# Altium project BatteryPack.PrjPcb
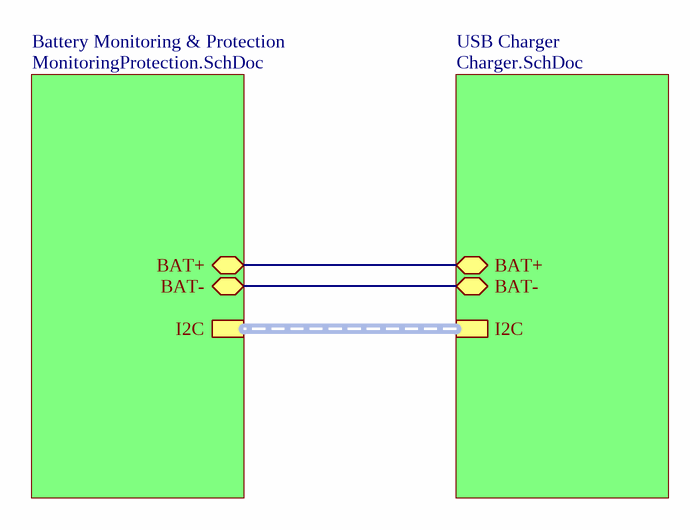
[diagram p0: Top.SchDoc]
seAuthor: Stefan Lüthi; seProject: robby; seRevision: 1.0
3 sheets, 60 parts. Net scope: hierarchical (ports join the sheet entries above them; power ports are global).
Board file: BatteryPack.PcbDoc
Sheets:
  Top.SchDoc
    Battery Monitoring & Protection = MonitoringProtection.SchDoc
    USB Charger = Charger.SchDoc

## Sheet Top.SchDoc
size A4; SheetNumber: 1; SheetTotal: 3

### Sub-sheets
Battery Monitoring & Protection = MonitoringProtection.SchDoc: BAT+ (bidir), I2C (harness I2C), BAT- (bidir)
USB Charger = Charger.SchDoc: BAT+ (bidir), I2C (harness I2C), BAT- (bidir)

### Nets
GND: sheet Battery Monitoring & Protection/BAT-, sheet USB Charger/BAT-
NetC301_2: sheet Battery Monitoring & Protection/BAT+, sheet USB Charger/BAT+

### Buses and harness runs
harness sheet Battery Monitoring & Protection/I2C = sheet USB Charger/I2C

### Notes on the sheet
- Project:
- Board:
- Title:
- Size:
- Sheet:
- A4
- of
- Drawn by:
- Revision:
- Date:
- Variant:
- Source Engineers GmbH | CH-3012 Bern
- File:

## Sheet MonitoringProtection.SchDoc
size A4; SheetNumber: 2; SheetTotal: 3
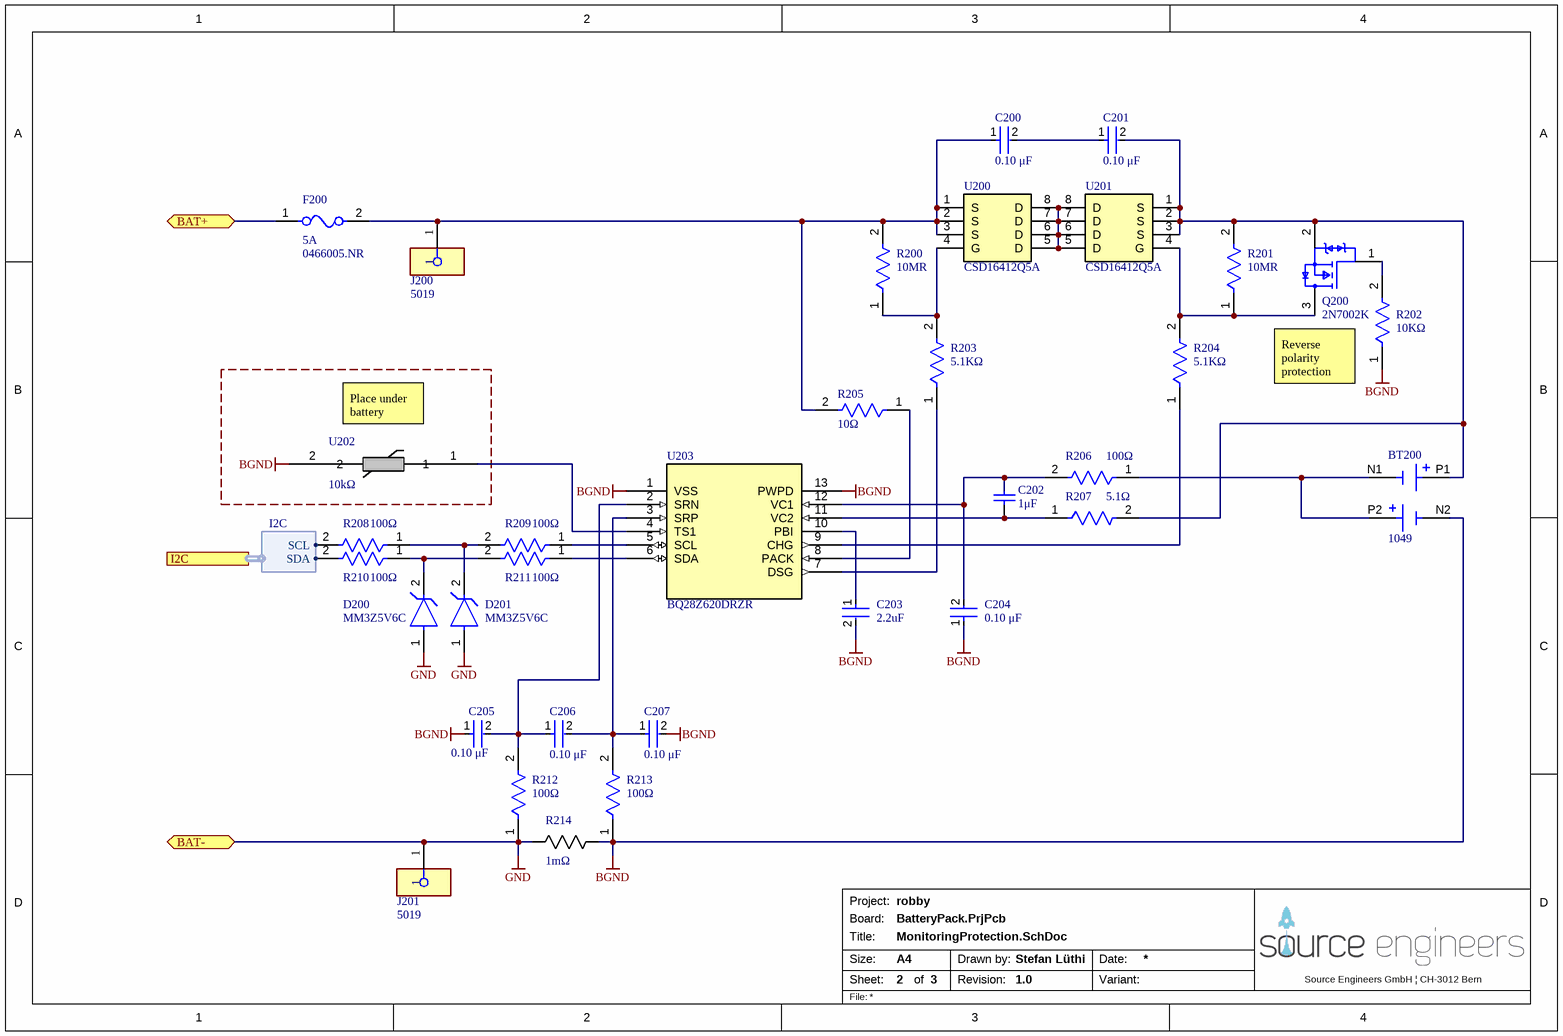
[diagram p1: MonitoringProtection.SchDoc]

### Parts
BT200  1049  [BAT1049]
C200  value 0.10 μF  [FP-C0603C-CF-MFG]  (hidden comment: C0603C104M5RACTU)
C201  value 0.10 μF  [FP-C0603C-CF-MFG]  (hidden comment: C0603C104M5RACTU)
C202  Parameter 1: 1μF  [CAPC2013X95X45NL10T25]  (hidden comment: GRM219R71E105KA88D)
C203  Capacitance: 2.2uF  [FP-GRM188-0_1-e0_2_0_5-MFG]  (hidden comment: GRM188R61E225KA12D)
C204  value 0.10 μF  [FP-C0603C-CF-MFG]  (hidden comment: C0603C104M5RACTU)
C205  value 0.10 μF  [FP-C0603C-CF-MFG]  (hidden comment: C0603C104M5RACTU)
C206  value 0.10 μF  [FP-C0603C-CF-MFG]  (hidden comment: C0603C104M5RACTU)
C207  value 0.10 μF  [FP-C0603C-CF-MFG]  (hidden comment: C0603C104M5RACTU)
D200  MM3Z5V6C  [FP-SOD-323F-MFG]
D201  MM3Z5V6C  [FP-SOD-323F-MFG]
F200  0466005.NR  Fuse Current: 5A  [FP-0466-MFG]
J200  5019  [FP-5019-MFG]
J201  5019  [FP-5019-MFG]
Q200  2N7002K  [FP-318-08-MFG]
R200  Resistance: 10MR  [FP-AC0603-IPC_C]  (hidden comment: AC0603FR-0710ML)
R201  Resistance: 10MR  [FP-AC0603-IPC_C]  (hidden comment: AC0603FR-0710ML)
R202  value 10KΩ  [FP-RT0603-MFG]  (hidden comment: RT0603FRE0710KL)
R203  Resistance: 5.1KΩ  [FP-RT0603-MFG]  (hidden comment: RT0603FRE075K1L)
R204  Resistance: 5.1KΩ  [FP-RT0603-MFG]  (hidden comment: RT0603FRE075K1L)
R205  Resistance: 10Ω  [FP-RT0603-MFG]  (hidden comment: RT0603FRE0710RL)
R206  Resistance: 100Ω  [FP-RT0603-MFG]  (hidden comment: RT0603FRE07100RL)
R207  Resistance: 5.1Ω  [FP-RT0603-MFG]  (hidden comment: RT0603FRE075R1L)
R208  Resistance: 100Ω  [FP-RT0603-MFG]  (hidden comment: RT0603FRE07100RL)
R209  Resistance: 100Ω  [FP-RT0603-MFG]  (hidden comment: RT0603FRE07100RL)
R210  Resistance: 100Ω  [FP-RT0603-MFG]  (hidden comment: RT0603FRE07100RL)
R211  Resistance: 100Ω  [FP-RT0603-MFG]  (hidden comment: RT0603FRE07100RL)
R212  Resistance: 100Ω  [FP-RT0603-MFG]  (hidden comment: RT0603FRE07100RL)
R213  Resistance: 100Ω  [FP-RT0603-MFG]  (hidden comment: RT0603FRE07100RL)
R214  Parameter 1: 1mΩ  [STA_CSNL1206_STP]  (hidden comment: CSNL1206FT1L00)
U200  CSD16412Q5A  [DQJ8]
U201  CSD16412Q5A  [DQJ8]
U202  Resistance: 10kΩ  [NTCS0603_VIS]  (hidden comment: NTCS0603E3103FLT)
U203  BQ28Z620DRZR  [VSON12_DRZ_TEX]

### Ports
BAT+ (bidir, see Top[2B], Charger[2B]), BAT- (bidir, see Top[2B], Charger[2B]), I2C (harness I2C, see Top[2C], Charger[4C])

### Harnesses
I2C: SCL, SDA

### Nets
BGND: BT200.N2(NEG2) C203.2 C204.1 C205.1 C207.2 R202.1 R213.1 R214.2 U202.2 U203.1(VSS) U203.13(PWPD)
GND: D200.1(A) D201.1(A) J201.1 R212.1 R214.1 ; port BAT-
NetBT200_N1: BT200.N1(NEG1) BT200.P2(POS2) R206.1
NetBT200_P1: BT200.P1(POS1) C201.2 Q200.2(Source) R201.2 R207.2 U201.1(S) U201.2(S) U201.3(S)
NetC200_1: C200.1 F200.2 J200.1 R200.2 R205.2 U200.1(S) U200.2(S) U200.3(S)
NetC200_2: C200.2 C201.1
NetC202_1: C202.1 R207.1 U203.11(VC2)
NetC202_2: C202.2 C204.2 R206.2 U203.12(VC1)
NetC203_1: C203.1 U203.10(PBI)
NetC205_2: C205.2 C206.1 R212.2 U203.2(SRN)
NetC206_2: C206.2 C207.1 R213.2 U203.3(SRP)
NetC301_2: F200.1 ; port BAT+
NetD200_2: D200.2(C) R210.1 R211.2
NetD201_2: D201.2(C) R208.1 R209.2
NetJ301_3: R208.2 ; port I2C.SCL
NetJ301_4: R210.2 ; port I2C.SDA
NetQ200_1: Q200.1(Gate) R202.2
NetQ200_3: Q200.3(Drain) R201.1 R204.2 U201.4(G)
NetR200_1: R200.1 R203.2 U200.4(G)
NetR203_1: R203.1 U203.7(DSG)
NetR204_1: R204.1 U203.9(CHG)
NetR205_1: R205.1 U203.8(PACK)
NetR209_1: R209.1 U203.5(SCL)
NetR211_1: R211.1 U203.6(SDA)
NetU200_5: U200.5(D) U200.6(D) U200.7(D) U200.8(D) U201.5(D) U201.6(D) U201.7(D) U201.8(D)
NetU202_1: U202.1 U203.4(TS1)

### Notes on the sheet
- Reverse polarity protection
- (near U202) Place under battery
- Project:
- Board:
- Title:
- Size:
- Sheet:
- A4
- of
- Drawn by:
- Revision:
- Date:
- Variant:
- Source Engineers GmbH | CH-3012 Bern
- File:

### Library data of the parts
BT200 = 1049: THM Holder for Dual 18650 Batteries; MF: Keystone Electronics; SnapEDA_Link: https://www.snapeda.com/parts/1049/Keystone/view-part/?ref=snap; Package: None; Value: *; MP: 1049; Check_prices: https://www.snapeda.com/parts/1049/Keystone/view-part/?ref=eda; Supplier 1: DigiKey; Supplier Part Number 1: 36-1049-ND; Supplier 2: Mouser; Supplier Part Number 2: 534-1049
C200 C201 C204-C207 = CMP-2006-03068-2: CAP CER 0.1UF 50V 20% X7R 0603; Manufacturer: KEMET; Material: Ceramic; Tolerance: 0.2; Temperature Coefficient: 30ppm/°C; Automotive Grade: Grade 1; Temperature Range High: +125°C; Voltage Rating: 50 V; Device Class L3: Ceramic Capacitors; Manufacturer Part Number: C0603C104M5RACTU; Height: 0.87mm; Category: Cap; RoHS: TRUE; Digikey Description: CAP CER 0.1UF 50V 20% X7R 0603; ComponentLink2URL: https://api.kemet.com/component-edge/download/datasheet/C0603C100J5GACAUTO.pdf; Lead Free: Yes; Temperature Range Low: -55°C; Device Class L1: Passive Components; ComponentLink2Description: Datasheet; Temperature Characteristic: X7R; Automotive: Yes; Temperature: -55°C to +125°C; Octopart: https://octopart.com/c0603c104m5ractu-kemet-11855687; Device Class L2: Capacitors; Package: C0603C-CF; Mouser Description: Multilayer Ceramic Capacitors MLCC - SMD/SMT 50volts 0.1uF X7R 20%; Capacitance: 0.10 μF
C202 = CMP-1036-04754-2: Manufacturer: Murata; Part Number: GRM219R71E105KA88D
C203 = CMP-2006-02820-2: Chip Multilayer Ceramic Capacitors for General Purpose, 0603, 2.2uF, X5R, 15%, 10%, 25V; Number of Pins: 2; Dielectric: X5R; Tolerance: 10%; Case Code (Imperial): 0603; Thickness: 0.035inch; Case/Package: 0603; Lead Free: Lead Free; Mount: Surface Mount; Material: Ceramic; Depth: 0.8mm; Voltage: 25V; Min Operating Temperature: -55°C; Package Quantity: 4000; REACH SVHC: No SVHC; Resistor Type: Ceramic; Packaging: Tape and Reel; Case Code (Metric): 1608; Max Operating Temperature: 85°C; Width: 0.8mm; Termination: SMD/SMT; Voltage Rating: 25V; Length: 1.6mm; Voltage Rating (DC): 25V; Height: 0.8mm; Radiation Hardening: No; Weight: 0.000222oz
D200 D201 = CMP-07164-000002-1: DIODE ZENER 5.6V 200MW SOD323F; Manufacturer: ON Semiconductor; Max Junction Temp: +150°C; Max Zener Voltage: 5.88V; Max Reverse Leakage Current: 0.9uA; Reverse Voltage: 2V; Zener Impedance: 37Ω; Device Class L2: Diodes; ComponentLink2Description: Datasheet; RoHS: TRUE; Digikey Description: DIODE ZENER 5.6V 200MW SOD323F; Mouser Description: Zener Diodes Diode Zener 5.6V 200mW 5%; ComponentLink2URL: https://www.onsemi.com/pub/Collateral/MM3Z9V1C-D.pdf; Octopart: https://octopart.com/mm3z5v6c-on+semiconductor-84329899; Category: Diode; Package: SOD-323F; Height: 1mm; Lead Free: Yes; Power Dissipation: 200mW; Temperature Range High: +150°C; Device Class L3: Zener Diodes; Automotive: No; Manufacturer Part Number: MM3Z5V6C; Nom Zener Voltage: 5.6V; Temperature: to +150°C; Device Class L1: Discrete Semiconductors
F200 = CMP-08605-000032-1: FUSE BOARD MNT 5A 32VAC/VDC 1206; Manufacturer: Littelfuse Inc; Value: 0.011Ω; Max Fuse Ac Voltage: 32V; Fuse I2T: 2.5A2Sec; Fuse Interrupt Ac Current: 50A; Fuse Blow Speed: Fast; Fuse Voltage Drop: 73.75mV; Category: Fuse; Temperature: -55°C to +90°C; Lead Free: Yes; Temperature Range High: +90°C; RoHS: TRUE; Device Class L2: Fuses; ComponentLink2URL: https://www.littelfuse.com/~/media/electronics/datasheets/fuses/littelfuse_fuse_466_datasheet.pdf.pdf; Octopart: https://octopart.com/0466005.nr-littelfuse-143206; Automotive: No; Max Fuse Dc Voltage: 32V; Temperature Range Low: -55°C; Device Class L3: unset; ComponentLink2Description: Datasheet; Manufacturer Part Number: 0466005.NR; Fuse Interrupt Dc Current: 50A; Resistance: 0.011Ω; Package: 0466; Device Class L1: Circuit Protection; Mouser Description: Surface Mount Fuses 32V 5A VFA Slimline; Height: 0.66mm; Voltage Rating: 32V; Digikey Description: FUSE BOARD MNT 5A 32VAC/VDC 1206
J200 J201 = CMP-1672-00008-2: NexarPartId: 22052288; Number of Contacts: 1; Contact Material: Bronze, Silver; Number of Pins: 1; Lead Free: Lead Free; Packaging: Tape and Reel; Mount: Surface Mount; Height: 2.286mm; Contact Plating: Silver; Material: Bronze; Termination: SMD/SMT; REACH SVHC: No SVHC; RoHS: Compliant
Q200 = CMP-07173-000009-1: MOSFET N-CH 60V 300MA SOT23; Manufacturer: ON Semiconductor; Turn Off Delay Time: 55.8ns; Max Forward Diode Voltage: 1.2V; Max Junction Temp: +150°C; Pulse Drain Current: 5A; Threshold Vgs Min: 1V; Depletion Mode: False; Drain To Source Resistance: 1.19Ω; Number Of N Channels: 1; Standoff Height: 0.01mm; Rthja Max: 417°C/W; Input Capacitace At Vds: 24.5pF @ 20V; Threshold Vgs Max: 2.3V; Turn On Delay Time: 12.2ns; Gate Charge At Vgs: 0.7nC @ 4.5V; Continuous Drain Current: 320mA; Transconductance: 0.53S; Power Dissipation: 300mW; Gate To Source Voltage: 20V; Typ Forward Diode Voltage: 0.8V; ComponentLink2URL: https://www.onsemi.com/pub/Collateral/2N7002K-D.pdf; RoHS: TRUE; Device Class L1: Discrete Semiconductors; ComponentLink2Description: Datasheet; Manufacturer Part Number: 2N7002K; Octopart: https://octopart.com/2n7002k-on+semiconductor-84408900; Device Class L3: MOSFETs; Mouser Description: N-Channel 60 V 2 Ohm SMT Enhancement Mode Field Effect Transistor SOT-23; Ipc Land Pattern Name: SOT95P240X100-3; Temperature Range High: +150°C; Temperature Range Low: -55°C; Lead Free: Yes; Height: 1.11mm; Package: 318-08; Footprint Url: https://www.onsemi.com/pub/Collateral/318-08.PDF; Temperature: -55°C to +150°C; Drain To Source Voltage: 60V; Device Class L2: Transistors; Drain To Source Breakdown Voltage: 60V; Digikey Description: MOSFET N-CH 60V 300MA SOT23; Number Of Channels: 1; Category: Trans; Automotive: No
R200 R201 = CMP-03412-018066-2: RES 10MΩ 1.00% 0.1W 0603; Voltage Rating: 50V; Temperature Coefficient: 100ppm/°C; Power Rating: 100mW; Tolerance: 1%; Length: 0.063inch; Weight: 7.1E-05oz; RoHS Compliant: Yes; Packaging: Tape and Reel; Features: Moisture Resistant; Series: AC; Max Power Dissipation: 100mW; Case Code (Metric): 1608; Width: 0.8mm; Number of Terminations: 2; Resistor Type: Thick Film; Min Operating Temperature: -55°C; Case Code (Imperial): 0603; Height: 0.022inch; Max Operating Temperature: 155°C; Case/Package: 0603; Termination: SMD/SMT
R202 = CMP-03412-005349-1: RES SMD 10K OHM 1% 1/10W 0603; Manufacturer: Yageo; Temperature Coefficient: 50 ppm/°C; Power Rating: 0.1W; Tolerance: 0.01; Voltage Rating: 75V; RoHS: TRUE; Category: Res; Automotive: No; Digikey Description: RES SMD 10K OHM 1% 1/10W 0603; ComponentLink2Description: Datasheet; Octopart: https://octopart.com/rt0603fre0710kl-yageo-40009243; ComponentLink2URL: http://www.yageo.com/documents/recent/PYu-RT_1-to-0.01_RoHS_L_9.pdf; Device Class L3: Chip SMD Resistors; Device Class L1: Passive Components; Temperature Range High: +155°C; Height: 0.55mm; Composition: Thin Film; Ipc Land Pattern Name: RESC16080X45; Series: RT; Package: RT0603; Resistance: 10KΩ; Footprint Url: http://www.yageo.com/exep/pages/download/literatures/PYu-R_Mount_10.pdf; Temperature: -55°C to +155°C; Temperature Range Low: -55°C; Lead Free: Yes; Device Class L2: Resistors; Mouser Description: Thin Film Resistors - SMD 10K ohm 1% 1/10W; Manufacturer Part Number: RT0603FRE0710KL
R203 R204 = CMP-2000-04778-2: RES SMD 5.1K OHM 1% 1/10W 0603; Manufacturer: Yageo; Value: 5.1KΩ; Temperature Coefficient: 50 ppm/°C; Power Rating: 0.1W; Voltage Rating: 75V; Tolerance: 0.01; Lead Free: Yes; Temperature Range High: +155°C; Package: RT0603; Series: RT; Footprint Url: http://www.yageo.com/exep/pages/download/literatures/PYu-R_Mount_10.pdf; Ipc Land Pattern Name: RESC16080X45; Mouser Description: Res Thin Film 0603 5.1K Ohm 1% 0.1W(1/10W) ±50ppm/C Epoxy Pad SMD T/R; Octopart: https://octopart.com/rt0603fre075k1l-yageo-1421390; ComponentLink2URL: http://www.yageo.com/documents/recent/PYu-RT_1-to-0.01_RoHS_L_9.pdf; Manufacturer Part Number: RT0603FRE075K1L; RoHS: TRUE; Device Class L3: Chip SMD Resistors; Digikey Description: RES SMD 5.1K OHM 1% 1/10W 0603; Temperature: -55°C to +155°C; Height: 0.55mm; Automotive: No; Device Class L1: Passive Components; Temperature Range Low: -55°C; Category: Res; Composition: Thin Film; ComponentLink2Description: Datasheet; Device Class L2: Resistors
R205 = CMP-03412-033408-1: RES SMD 10 OHM 1% 1/10W 0603; Manufacturer: Yageo; Voltage Rating: 75V; Power Rating: 0.1W; Temperature Coefficient: 50 ppm/°C; Tolerance: 0.01; Value: 10Ω; Footprint Url: http://www.yageo.com/exep/pages/download/literatures/PYu-R_Mount_10.pdf; Ipc Land Pattern Name: RESC16080X45; RoHS: TRUE; Device Class L2: Resistors; Device Class L3: Chip SMD Resistors; Category: Res; Device Class L1: Passive Components; Manufacturer Part Number: RT0603FRE0710RL; ComponentLink2URL: http://www.yageo.com/documents/recent/PYu-RT_1-to-0.01_RoHS_L_9.pdf; Temperature Range Low: -55°C; Height: 0.55mm; Digikey Description: RES SMD 10 OHM 1% 1/10W 0603; Temperature Range High: +155°C; Lead Free: Yes; Composition: Thin Film; Mouser Description: Thin Film Resistors - SMD 1/10W 10 ohm 1% 50ppm; Automotive: No; Package: RT0603; Temperature: -55°C to +155°C; Series: RT; ComponentLink2Description: Datasheet; Octopart: https://octopart.com/rt0603fre0710rl-yageo-39827693
R206 R208-R213 = CMP-03412-022806-1: RES SMD 100 OHM 1% 1/10W 0603; Manufacturer: Yageo; Value: 100Ω; Power Rating: 0.1W; Voltage Rating: 75V; Temperature Coefficient: 50 ppm/°C; Tolerance: 0.01; Manufacturer Part Number: RT0603FRE07100RL; Mouser Description: Thin Film Resistors - SMD 1/10W 100 ohm 1% 50ppm; Ipc Land Pattern Name: RESC16080X45; Height: 0.55mm; Category: Res; Temperature Range Low: -55°C; Lead Free: Yes; Automotive: No; Device Class L3: Chip SMD Resistors; ComponentLink2Description: Datasheet; Device Class L2: Resistors; RoHS: TRUE; Footprint Url: http://www.yageo.com/exep/pages/download/literatures/PYu-R_Mount_10.pdf; Digikey Description: RES SMD 100 OHM 1% 1/10W 0603; Temperature Range High: +155°C; Package: RT0603; Device Class L1: Passive Components; Series: RT; Temperature: -55°C to +155°C; Octopart: https://octopart.com/rt0603fre07100rl-yageo-39792638; Composition: Thin Film; ComponentLink2URL: http://www.yageo.com/documents/recent/PYu-RT_1-to-0.01_RoHS_L_9.pdf
R207 = CMP-03412-016927-1: RES SMD 5.1 OHM 1% 1/10W 0603; Manufacturer: Yageo; Tolerance: 0.01; Voltage Rating: 75V; Value: 5.1Ω; Temperature Coefficient: 50 ppm/°C; Power Rating: 0.1W; ComponentLink2URL: http://www.yageo.com/documents/recent/PYu-RT_1-to-0.01_RoHS_L_9.pdf; Temperature Range High: +155°C; Manufacturer Part Number: RT0603FRE075R1L; Composition: Thin Film; Octopart: https://octopart.com/rt0603fre075r1l-yageo-25630341; Device Class L1: Passive Components; Digikey Description: RES SMD 5.1 OHM 1% 1/10W 0603; Series: RT; Lead Free: Yes; Device Class L3: Chip SMD Resistors; Temperature: -55°C to +155°C; ComponentLink2Description: Datasheet; Category: Res; Height: 0.55mm; Package: RT0603; Automotive: No; Ipc Land Pattern Name: RESC16080X45; Device Class L2: Resistors; Footprint Url: http://www.yageo.com/exep/pages/download/literatures/PYu-R_Mount_10.pdf; RoHS: TRUE; Temperature Range Low: -55°C
R214 = CSNL1206FT1L00: Description; Manufacturer_Name: Stackpole International; Copyright: Copyright (C) 2025 Ultra Librarian. All rights reserved.; Manufacturer_Part_Number: CSNL1206FT1L00; Supplier 1: DigiKey; Supplier Part Number 1: CSNL1206FT1L00CT-ND; Supplier 2: DigiKey; Supplier Part Number 2: CSNL1206FT1L00DKR-ND; Supplier 3: DigiKey; Supplier Part Number 3: CSNL1206FT1L00TR-ND; Supplier 4: Mouser; Supplier Part Number 4: 708-CSNL1206FT1L00
U200 U201 = CSD16412Q5A: 25-V, N channel NexFETâ„¢ power MOSFET, single SON 5 mm x 6 mm, 16 mOhm 8-VSONP -55 to 150; Manufacturer_Name: Texas Instruments; Copyright: Copyright (C) 2025 Ultra Librarian. All rights reserved.; Manufacturer_Part_Number: CSD16412Q5A; Datasheet: https://www.ti.com/lit/gpn/csd16412q5a; RefDes: RefDes; Type: Type; Supplier 1: DigiKey; Supplier Part Number 1: 296-24256-1-ND; Supplier 2: DigiKey; Supplier Part Number 2: 296-24256-6-ND; Supplier 3: Mouser; Supplier Part Number 3: 595-CSD16412Q5A
U202 = CMP-02404-000014-2: THERMISTOR NTC 10KOHM 3435K 0603; NexarPartId: 44562204; Tolerance: 1%; Power Rating: 125mW; Case Code (Metric): 1608; Packaging: Cut Tape (CT); Min Operating Temperature: -40°C; RoHS: Compliant; Height: 800µm; Depth: 800µm; Case/Package: 0603; Length: 1.6mm; Number of Pins: 2; Termination: SMD/SMT; Schedule B: 8533400080, 8533400080; Weight: 1.19068mg; Contact Plating: Tin; Max Power Dissipation: 125mW; Max Operating Temperature: 150°C; Mount: Surface Mount; Case Code (Imperial): 0603; Width: 800µm
U203 = BQ28Z620DRZR: Battery fuel gauge with integrated protector for 1-series to 2 series packs with 1.2-V I/O 12-SON -40 to 85; Manufacturer_Name: Texas Instruments; Type: Power Management; Copyright: Copyright (C) 2025 Ultra Librarian. All rights reserved.; Manufacturer_Part_Number: BQ28Z620DRZR; RefDes: RefDes; Supplier 1: DigiKey; Supplier Part Number 1: 296-BQ28Z620DRZRCT-ND; Supplier 2: DigiKey; Supplier Part Number 2: 296-BQ28Z620DRZRDKR-ND; Supplier 3: Mouser; Supplier Part Number 3: 595-BQ28Z620DRZR

## Sheet Charger.SchDoc
size A4; SheetNumber: 3; SheetTotal: 3
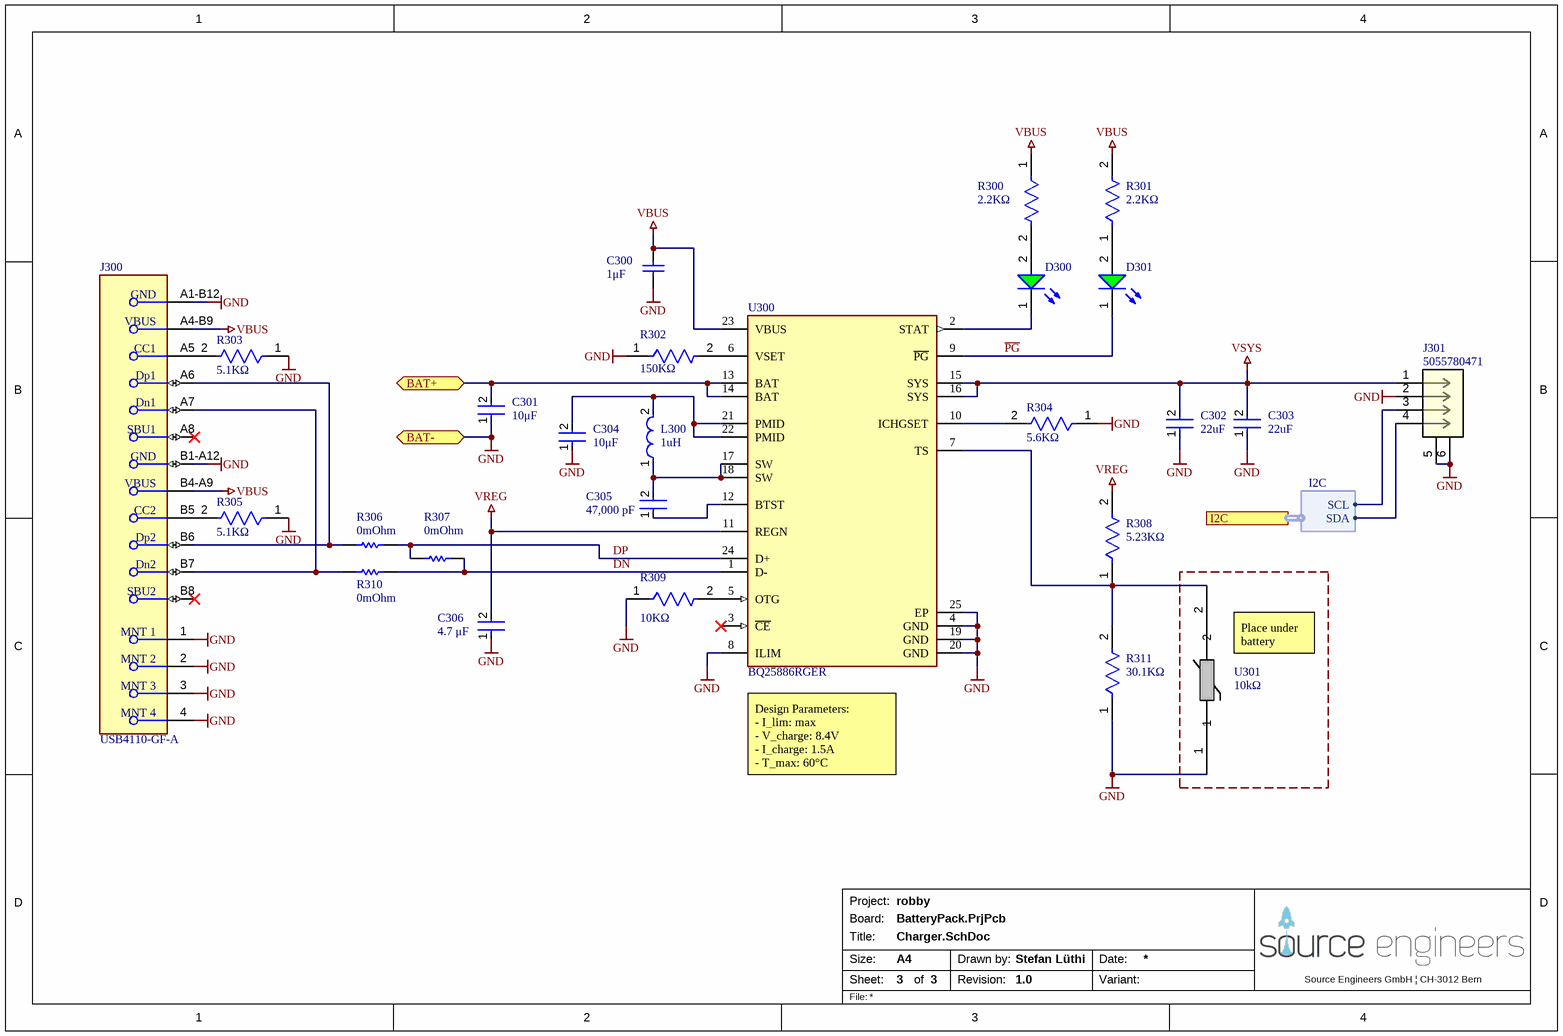
[diagram p2: Charger.SchDoc]

### Parts
C300  Parameter 1: 1μF  [CAPC2013X95X45NL10T25]  (hidden comment: GRM219R71E105KA88D)
C301  value 10μF  [FP-GRM31C-0_2-e0_3_0_8-IPC_B]  (hidden comment: GRM31CR71E106MA12K)
C302  Capacitance: 22uF  [FP-GRM32E-0_3-0_2-MFG]  (hidden comment: GRM32ER71E226ME15K)
C303  Capacitance: 22uF  [FP-GRM32E-0_3-0_2-MFG]  (hidden comment: GRM32ER71E226ME15K)
C304  value 10μF  [FP-GRM31C-0_2-e0_3_0_8-IPC_B]  (hidden comment: GRM31CR71E106MA12K)
C305  value 47,000 pF  [FP-C0603C-CF-MFG]  (hidden comment: C0603C473M5RACTU)
C306  Parameter 1: 4.7 μF  [FP-GRM188-0_15-IPC_B]  (hidden comment: GRM188Z71A475ME15D)
D300  155060VS75300  [WL-SMSW_0603_L1.6W0.98H0.8]  (value not drawn)
D301  155060VS75300  [WL-SMSW_0603_L1.6W0.98H0.8]  (value not drawn)
J300  USB4110-GF-A  [FP-USB4110-GF-A-MFG]
J301  5055780471  [CONN_505578_04_MOL]
L300  Inductance: 1uH  [FP-IHLP-2525CZ-FP_2_413x3-MFG]  (hidden comment: IHLP2525CZER1R0M01)
R300  value 2.2KΩ  [FP-RT0603-MFG]  (hidden comment: RT0603FRE072K2L)
R301  value 2.2KΩ  [FP-RT0603-MFG]  (hidden comment: RT0603FRE072K2L)
R302  value 150KΩ  [FP-RT0603-MFG]  (hidden comment: RT0603FRE07150KL)
R303  Resistance: 5.1KΩ  [FP-RT0603-MFG]  (hidden comment: RT0603FRE075K1L)
R304  value 5.6KΩ  [FP-RT0603-MFG]  (hidden comment: RT0603FRE075K6L)
R305  Resistance: 5.1KΩ  [FP-RT0603-MFG]  (hidden comment: RT0603FRE075K1L)
R306  Resistance: 0mOhm  [RESC1608X55X25ML10T15]  (hidden comment: RC0603JR-070RL)
R307  Resistance: 0mOhm  [RESC1608X55X25ML10T15]  (hidden comment: RC0603JR-070RL)
R308  value 5.23KΩ  [FP-RT0603-MFG]  (hidden comment: RT0603FRE075K23L)
R309  value 10KΩ  [FP-RT0603-MFG]  (hidden comment: RT0603FRE0710KL)
R310  Resistance: 0mOhm  [RESC1608X55X25ML10T15]  (hidden comment: RC0603JR-070RL)
R311  value 30.1KΩ  [FP-RT0603-MFG]  (hidden comment: RT0603FRE0730K1L)
U300  BQ25886RGER  [FP-RGE0024H-IPC_C]
U301  Resistance: 10kΩ  [NTCS0603_VIS]  (hidden comment: NTCS0603E3103FLT)

### Ports
BAT+ (bidir, see Top[3B], MonitoringProtection[1A]), BAT- (bidir, see Top[3B], MonitoringProtection[1D]), I2C (harness I2C, see Top[3C], MonitoringProtection[1C])

### Harnesses
I2C: SCL, SDA

### Nets
GND: C300.1 C301.1 C302.1 C303.1 C304.1 C306.1 J300.1(MNT_1) J300.2(MNT_2) J300.3(MNT_3) J300.4(MNT_4) J300.A1-B12(GND) J300.B1-A12(GND) J301.2 J301.5 J301.6 R302.1 R303.1 R304.1 R305.1 R309.1 R311.1 U300.4(GND) U300.8(ILIM) U300.19(GND) U300.20(GND) U300.25(EP) U301.1 ; port BAT-
VBUS: C300.2 J300.A4-B9(VBUS) J300.B4-A9(VBUS) R300.1 R301.2 U300.23(VBUS)
VREG: C306.2 R308.2 U300.11(REGN)
VSYS: C302.2 C303.2 J301.1 U300.15(SYS) U300.16(SYS)
DN: R307.1 R310.1 U300.1(D-)
DP: R306.1 R307.2 U300.24(D+)
~{PG}: D301.1(K) U300.9(~{PG})
NetC301_2: C301.2 U300.13(BAT) U300.14(BAT) ; port BAT+
NetC304_2: C304.2 L300.2 U300.21(PMID) U300.22(PMID)
NetC305_1: C305.1 U300.12(BTST)
NetC305_2: C305.2 L300.1 U300.17(SW) U300.18(SW)
NetD300_1: D300.1(K) U300.2(STAT)
NetD300_2: D300.2(A) R300.2
NetD301_2: D301.2(A) R301.1
NetJ300_A5: J300.A5(CC1) R303.2
NetJ300_A6: J300.A6(Dp1) J300.B6(Dp2) R306.2
NetJ300_A7: J300.A7(Dn1) J300.B7(Dn2) R310.2
NetJ300_B5: J300.B5(CC2) R305.2
NetJ301_3: J301.3 ; port I2C.SCL
NetJ301_4: J301.4 ; port I2C.SDA
NetR302_2: R302.2 U300.6(VSET)
NetR304_2: R304.2 U300.10(ICHGSET)
NetR308_1: R308.1 R311.2 U300.7(TS) U301.2
NetR309_2: R309.2 U300.5(OTG)

Not connected (* = marked no-connect by the designer): J300 A8(SBU1)* B8(SBU2)*; U300 3(~{CE})*

### Notes on the sheet
- (near U301) Place under battery
- (near U300) Design Parameters:
  - I_lim: max
  - V_charge: 8.4V
  - I_charge: 1.5A
  - T_max: 60°C
- Project:
- Board:
- Title:
- Size:
- Sheet:
- A4
- of
- Drawn by:
- Revision:
- Date:
- Variant:
- Source Engineers GmbH | CH-3012 Bern
- File:

### Library data of the parts
C300 = CMP-1036-04754-2: Manufacturer: Murata; Part Number: GRM219R71E105KA88D
C301 C304 = CMP-06035-043219-1: Chip Multilayer Ceramic Capacitors for General Purpose, 1206, 10uF, X7R, 15%, 20%, 25V
C302 C303 = CMP-06035-000114-2: Chip Multilayer Ceramic Capacitors for General Purpose, 1210, 22uF, X7R, 15%, 20%, 25V; Case Code (Metric): 3225; Thickness: 0.106inch; Voltage Rating: 25V; Weight: 0.00388oz; Width: 0.098inch; Case Code (Imperial): 1210; Tolerance: 20%; Termination: SMD/SMT; Packaging: Tape and Reel; Case/Package: 1210; Height: 2.5mm; Mount: Surface Mount; Voltage Rating (DC): 25V; Resistor Type: Ceramic; Voltage: 25V; Dielectric: X7R; Package Quantity: 4000; Min Operating Temperature: -55°C; Max Operating Temperature: 125°C; Length: 0.126inch
C305 = CMP-2006-03851-2: CAP CER 0.047UF 50V X7R 0603; Manufacturer: KEMET; Temperature Coefficient: 30ppm/°C; Automotive Grade: Grade 1; Tolerance: 0.2; Material: Ceramic; Voltage Rating: 50 V; Manufacturer Part Number: C0603C473M5RACTU; Device Class L1: Passive Components; Temperature Range High: +125°C; Height: 0.87mm; Device Class L3: Ceramic Capacitors; Capacitance: 47,000 pF; Digikey Description: CAP CER 0.047UF 50V X7R 0603; Temperature Range Low: -55°C; Temperature: -55°C to +125°C; Mouser Description: Cap Ceramic 0.047uF 50V X7R 20% SMD 0603 125°C Paper T/R; ComponentLink2URL: https://api.kemet.com/component-edge/download/datasheet/C0603C100J5GACAUTO.pdf; Package: C0603C-CF; Automotive: Yes; RoHS: TRUE; ComponentLink2Description: Datasheet; Lead Free: Yes; Device Class L2: Capacitors; Temperature Characteristic: X7R; Category: Cap; Octopart: https://octopart.com/c0603c473m5ractu-kemet-9140001
C306 = CMP-06035-024346-1: Chip Multilayer Ceramic Capacitors for General Purpose, 0603, 4.7uF, X7R, 15%, 20%, 10V; Case/Package: 0603
D300 D301 = CMP-03913-108242161-1: 155060VS75300 Led, Green, 60Mcd, 570Nm Rohs Compliant: Yes; Max Reverse Voltage (DC): 5V; Peak Wavelength: 572nm; Viewing Angle: 140°; Forward Current: 30mA; Forward Voltage: 2V; Max Operating Temperature: 85°C; Luminous Intensity: 60mcd; RoHS: Compliant; Width: 980µm; Length: 1.6mm; Min Operating Temperature: -40°C; Dominant Wavelength: 570nm; Height: 800µm; NexarPartId: 108242161
J300 = CMP-245163-000002-1: CONN USB 2.0 TYPE-C R/A SMT; Manufacturer: GCT; Conn Orientation: Right Angle; Usb Standard: USB 2.0; Voltage Rating: 20V; Current Rating: 3/4.25/1.25/0.25A; Number Of Contacts: 16; Is Female: yes; Shielding: true; Standoff Height: 0.1mm; Octopart: https://octopart.com/usb4110-gf-a-gct-103941985; Temperature: -40°C to +85°C; RoHS: TRUE; Automotive: No; Contact Material: Gold,Nickel; Device Class L1: Connectors; Device Class L2: USB Connectors; Package: 0; Lead Free: Yes; ComponentLink2URL: https://gct.co/files/drawings/usb4110.pdf; Temperature Range High: +85°C; Temperature Range Low: -40°C; Height: 3.46mm; Manufacturer Part Number: USB4110-GF-A; ComponentLink2Description: Datasheet; Device Class L3: unset; Digikey Description: CONN USB 2.0 TYPE-C R/A SMT; Category: Conn
J301 = 5055780471: 2.00mm Pitch, Micro-Lock Plus PCB Header, Single Row, Right-Angle, Surface Mount, Matte Tin Plating, Positive Lock, 4 Circuits, Low-Halogen, Black; Manufacturer_Name: Molex Connector Corporation; Copyright: Copyright (C) 2025 Ultra Librarian. All rights reserved.; Manufacturer_Part_Number: 5055780471; Datasheet: https://www.molex.com/en-us/products/part-detail-pdf/5055780471?display=pdf; RefDes: RefDes; Type: Type; Supplier 1: DigiKey; Supplier Part Number 1: WM17949CT-ND; Supplier 2: DigiKey; Supplier Part Number 2: WM17949DKR-ND; Supplier 3: Mouser; Supplier Part Number 3: 538-505578-0471
L300 = CMP-02424-000599-1: Commercial Inductors, High Saturation Series 1uH 11A 10mΩ 20%; Self Resonant Frequency: 5MHz; Test Frequency: 100kHz; Shielding: Shielded; Core Material: Metal; Saturation Current: 22A; DC Resistance (DCR): 10mR; Current Rating: 11A; Packaging: Tape and Reel; Width: 6.47mm; Number of Pins: 2; Case/Package: 2525; Termination: SMD/SMT; Length: 7.24mm; Height: 3mm; Min Operating Temperature: -55°C; Mount: Surface Mount; Inductance Tolerance: 20%; Max Operating Temperature: 125°C; Military Standard: Not; Max DC Current: 11A; RMS Current (Irms): 11A; Lead Free: Lead Free; Depth: 6.72mm; Tolerance: 20%; Package Quantity: 2000; Radiation Hardening: No; Contact Plating: Tin
R300 R301 = CMP-03412-033768-1: RES SMD 2.2K OHM 1% 1/10W 0603; Manufacturer: Yageo; Temperature Coefficient: 50 ppm/°C; Power Rating: 0.1W; Tolerance: 0.01; Voltage Rating: 75V; Package: RT0603; Digikey Description: RES SMD 2.2K OHM 1% 1/10W 0603; Octopart: https://octopart.com/rt0603fre072k2l-yageo-40019811; ComponentLink2URL: http://www.yageo.com/documents/recent/PYu-RT_1-to-0.01_RoHS_L_9.pdf; Temperature Range Low: -55°C; Height: 0.55mm; Footprint Url: http://www.yageo.com/exep/pages/download/literatures/PYu-R_Mount_10.pdf; ComponentLink2Description: Datasheet; Device Class L1: Passive Components; RoHS: TRUE; Device Class L3: Chip SMD Resistors; Composition: Thin Film; Device Class L2: Resistors; Manufacturer Part Number: RT0603FRE072K2L; Mouser Description: High Precision-High Stability Chip Resistor Thin Film 0603 2.2kOhm 1% Paper T/R; Automotive: No; Category: Res; Temperature Range High: +155°C; Lead Free: Yes; Resistance: 2.2KΩ; Temperature: -55°C to +155°C; Series: RT; Ipc Land Pattern Name: RESC16080X45
R302 = CMP-03412-003286-1: RES SMD 150K OHM 1% 1/10W 0603; Manufacturer: Yageo; Power Rating: 0.1W; Voltage Rating: 75V; Tolerance: 0.01; Temperature Coefficient: 50 ppm/°C; Temperature Range Low: -55°C; Category: Res; Mouser Description: High Precision-High Stability Chip Resistor Thin Film 0603 150kOhm 1% Paper T/R; Temperature Range High: +155°C; ComponentLink2Description: Datasheet; Digikey Description: RES SMD 150K OHM 1% 1/10W 0603; Ipc Land Pattern Name: RESC16080X45; Automotive: No; Temperature: -55°C to +155°C; Package: RT0603; Device Class L2: Resistors; RoHS: TRUE; Footprint Url: http://www.yageo.com/exep/pages/download/literatures/PYu-R_Mount_10.pdf; ComponentLink2URL: http://www.yageo.com/documents/recent/PYu-RT_1-to-0.01_RoHS_L_9.pdf; Composition: Thin Film; Manufacturer Part Number: RT0603FRE07150KL; Octopart: https://octopart.com/rt0603fre07150kl-yageo-39990114; Resistance: 150KΩ; Lead Free: Yes; Height: 0.55mm; Series: RT; Device Class L3: Chip SMD Resistors; Device Class L1: Passive Components
R303 R305 = CMP-2000-04778-2: as R203 on sheet MonitoringProtection; Lead Free: Yes; Temperature Range High: +155°C; Package: RT0603; Series: RT; Footprint Url: http://www.yageo.com/exep/pages/download/literatures/PYu-R_Mount_10.pdf; Ipc Land Pattern Name: RESC16080X45; Mouser Description: Res Thin Film 0603 5.1K Ohm 1% 0.1W(1/10W) ±50ppm/C Epoxy Pad SMD T/R; Octopart: https://octopart.com/rt0603fre075k1l-yageo-1421390; ComponentLink2URL: http://www.yageo.com/documents/recent/PYu-RT_1-to-0.01_RoHS_L_9.pdf; Manufacturer Part Number: RT0603FRE075K1L; RoHS: TRUE; Device Class L3: Chip SMD Resistors; Digikey Description: RES SMD 5.1K OHM 1% 1/10W 0603; Temperature: -55°C to +155°C; Height: 0.55mm; Automotive: No; Device Class L1: Passive Components; Temperature Range Low: -55°C; Category: Res; Composition: Thin Film; ComponentLink2Description: Datasheet; Device Class L2: Resistors
R304 = CMP-03412-009081-1: RES SMD 5.6K OHM 1% 1/10W 0603; Manufacturer: Yageo; Tolerance: 0.01; Voltage Rating: 75V; Temperature Coefficient: 50 ppm/°C; Power Rating: 0.1W; Package: RT0603; Manufacturer Part Number: RT0603FRE075K6L; Footprint Url: http://www.yageo.com/exep/pages/download/literatures/PYu-R_Mount_10.pdf; Composition: Thin Film; Category: Res; RoHS: TRUE; Resistance: 5.6KΩ; ComponentLink2Description: Datasheet; Lead Free: Yes; Automotive: No; Temperature Range Low: -55°C; Series: RT; Temperature: -55°C to +155°C; Mouser Description: Res Thin Film 0603 5.6K Ohm 1% 1/10W ?50ppm/C Molded SMD SMD Paper T/R; Temperature Range High: +155°C; Device Class L3: Chip SMD Resistors; Digikey Description: RES SMD 5.6K OHM 1% 1/10W 0603; Octopart: https://octopart.com/rt0603fre075k6l-yageo-40030215; Device Class L2: Resistors; Ipc Land Pattern Name: RESC16080X45; Device Class L1: Passive Components; ComponentLink2URL: http://www.yageo.com/documents/recent/PYu-RT_1-to-0.01_RoHS_L_9.pdf; Height: 0.55mm
R306 R307 R310 = CMP-2100-03667-1: Chip Resistor, 0 Ohm, +/- 5%, 0.1 W, -55 to 155 degC, 0603 (1608 Metric), RoHS, Tape and Reel; Manufacturer: Yageo; Temperature Coefficient: 200ppm/degreesC; Voltage Rating: 50V; Power Rating: 100mW; Width: 0.8mm; Max Operating Temperature: 155degC; Tolerance: 5%; Package Reference: 0603; Height: 0.45mm; Depth: 0.8mm; Package Description: 2-Pin Surface Mount Device, Body 1.6 x 0.8 mm; Termination: SMD/SMT; Package Quantity: 5000; Case/Package: 0603; Case Code (Imperial): 0603; Radiation Hardening: No; Number of Pins: 2; Length: 1.6mm; Lead Free: LeadFree; Voltage Rating (DC): 50V; Military Standard: Not; Datasheet URL: http://www.yageo.com/NewPortal/yageodocoutput?fileName=/pdf/R-Chip/PYu-RC_Group_51_RoHS_L_5.pdf; Manufacturer URL: http://www.yageo.com/; Packaging: TapeandReel; Case Code (Metric): 1608; Min Operating Temperature: -55degC; Composition: ThickFilm; RoHSCompliant: true; Contact Plating: Tin; Datasheet Version: Rev. 5, 10/2016; REACH SVHC: NoSVHC
R308 = CMP-03412-006003-1: RES SMD 5.23K OHM 1% 1/10W 0603; Manufacturer: Yageo; Temperature Coefficient: 50 ppm/°C; Voltage Rating: 75V; Power Rating: 0.1W; Tolerance: 0.01; Device Class L2: Resistors; Temperature Range High: +155°C; ComponentLink2Description: Datasheet; Octopart: https://octopart.com/rt0603fre075k23l-yageo-1422860; Height: 0.55mm; Mouser Description: Thin Film Resistors 1/10W 5.23K ohm 1% 50ppm; Manufacturer Part Number: RT0603FRE075K23L; Composition: Thin Film; Series: RT; Resistance: 5.23KΩ; Automotive: No; Device Class L1: Passive Components; RoHS: TRUE; Package: RT0603; Lead Free: Yes; Footprint Url: http://www.yageo.com/exep/pages/download/literatures/PYu-R_Mount_10.pdf; Temperature Range Low: -55°C; ComponentLink2URL: http://www.yageo.com/documents/recent/PYu-RT_1-to-0.01_RoHS_L_9.pdf; Device Class L3: Chip SMD Resistors; Digikey Description: RES SMD 5.23K OHM 1% 1/10W 0603; Ipc Land Pattern Name: RESC16080X45; Temperature: -55°C to +155°C; Category: Res
R309 = CMP-03412-005349-1: as R202 on sheet MonitoringProtection; RoHS: TRUE; Category: Res; Automotive: No; Digikey Description: RES SMD 10K OHM 1% 1/10W 0603; ComponentLink2Description: Datasheet; Octopart: https://octopart.com/rt0603fre0710kl-yageo-40009243; ComponentLink2URL: http://www.yageo.com/documents/recent/PYu-RT_1-to-0.01_RoHS_L_9.pdf; Device Class L3: Chip SMD Resistors; Device Class L1: Passive Components; Temperature Range High: +155°C; Height: 0.55mm; Composition: Thin Film; Ipc Land Pattern Name: RESC16080X45; Series: RT; Package: RT0603; Resistance: 10KΩ; Footprint Url: http://www.yageo.com/exep/pages/download/literatures/PYu-R_Mount_10.pdf; Temperature: -55°C to +155°C; Temperature Range Low: -55°C; Lead Free: Yes; Device Class L2: Resistors; Mouser Description: Thin Film Resistors - SMD 10K ohm 1% 1/10W; Manufacturer Part Number: RT0603FRE0710KL
R311 = CMP-2000-04723-2: RES SMD 30.1K OHM 1% 1/10W 0603; Manufacturer: Yageo; Power Rating: 0.1W; Temperature Coefficient: 50 ppm/°C; Tolerance: 0.01; Voltage Rating: 75V; RoHS: TRUE; Temperature: -55°C to +155°C; Device Class L3: Chip SMD Resistors; Lead Free: Yes; Temperature Range Low: -55°C; ComponentLink2Description: Datasheet; Automotive: No; Height: 0.55mm; Footprint Url: http://www.yageo.com/exep/pages/download/literatures/PYu-R_Mount_10.pdf; ComponentLink2URL: http://www.yageo.com/documents/recent/PYu-RT_1-to-0.01_RoHS_L_9.pdf; Octopart: https://octopart.com/rt0603fre0730k1l-yageo-1278177; Series: RT; Ipc Land Pattern Name: RESC16080X45; Category: Res; Digikey Description: RES SMD 30.1K OHM 1% 1/10W 0603; Device Class L1: Passive Components; Package: RT0603; Composition: Thin Film; Temperature Range High: +155°C; Mouser Description: Res Thin Film 0603 30.1K Ohm 1% 1/10W ±50ppm/°C SMD Paper T/R; Device Class L2: Resistors; Manufacturer Part Number: RT0603FRE0730K1L; Resistance: 30.1KΩ
U300 = CMP-04911-000046-1: PWR MGMT BATTERY MGMT
U301 = CMP-02404-000014-2: as U202 on sheet MonitoringProtection; Case Code (Metric): 1608; Packaging: Cut Tape (CT); Min Operating Temperature: -40°C; RoHS: Compliant; Height: 800µm; Depth: 800µm; Case/Package: 0603; Length: 1.6mm; Number of Pins: 2; Termination: SMD/SMT; Schedule B: 8533400080, 8533400080; Weight: 1.19068mg; Contact Plating: Tin; Max Power Dissipation: 125mW; Max Operating Temperature: 150°C; Mount: Surface Mount; Case Code (Imperial): 0603; Width: 800µm

## Nets that join several sheets
GND: MonitoringProtection (5 pins), Charger (27 pins)
NetC301_2: MonitoringProtection (F200.1), Charger (C301.2 U300.13 U300.14)
NetJ301_3: MonitoringProtection (R208.2), Charger (J301.3)
NetJ301_4: MonitoringProtection (R210.2), Charger (J301.4)

## Assembly variants
Default: not fitted R? R?